# Altium project RFControllerSignalBoard.PrjPcb
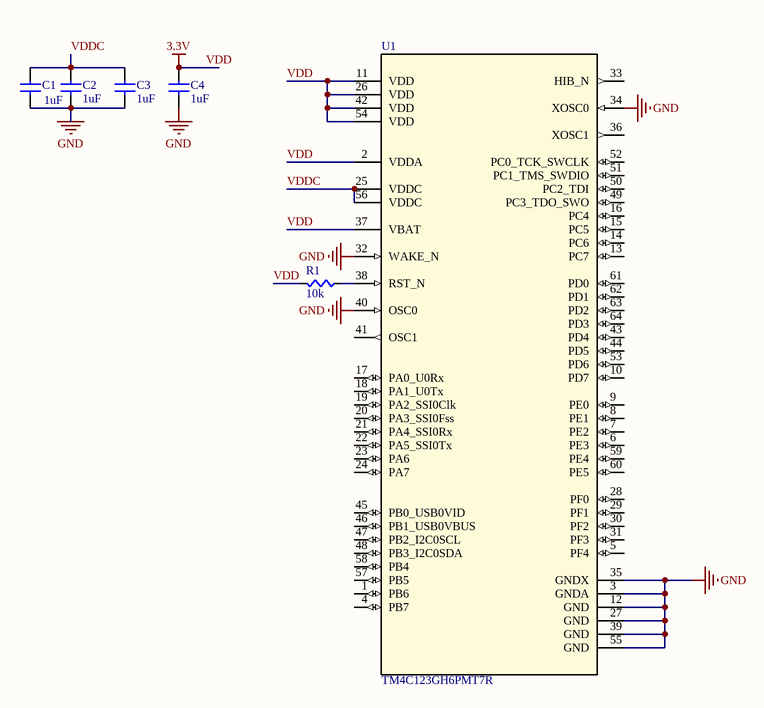
[diagram p0: MCU.SchDoc]
2 sheets, 16 parts. Net scope: global (net labels, ports and power ports of the same name join across sheets).
Sheets:
  MCU.SchDoc
  Power.SchDoc

## Sheet MCU.SchDoc
size A; SheetNumber: 1; SheetTotal: 3

### Parts
C1  value 1uF  [CAPC0805]  (hidden comment: Cap)
C2  value 1uF  [CAPC0805]  (hidden comment: Cap)
C3  value 1uF  [CAPC0805]  (hidden comment: Cap)
C4  value 1uF  [CAPC0805]  (hidden comment: Cap)
R1  value 10k  [RES0603]  (hidden comment: Res)
U1  TM4C123GH6PMT7R  [TM4C123GH6PMT7R_L]

### Nets
GND: C1.2(B) C2.2(B) C3.2(B) C4.2(B) U1.3(GNDA) U1.12(GND) U1.27(GND) U1.32(WAKE_N) U1.34(XOSC0) U1.35(GNDX) U1.39(GND) U1.40(OSC0) U1.55(GND)
VDD: C4.1(A) R1.1(A) U1.2(VDDA) U1.11(VDD) U1.26(VDD) U1.37(VBAT) U1.42(VDD) U1.54(VDD)  [also labelled 3.3V]
VDDC: C1.1(A) C2.1(A) C3.1(A) U1.25(VDDC) U1.56(VDDC)
NetR1_2: R1.2(B) U1.38(RST_N)

Not connected (* = marked no-connect by the designer): U1 1(PB6) 4(PB7) 5(PF4) 6(PE3) 7(PE2) 8(PE1) 9(PE0) 10(PD7) 13(PC7) 14(PC6) 15(PC5) 16(PC4) 17(PA0_U0Rx) 18(PA1_U0Tx) 19(PA2_SSI0Clk) 20(PA3_SSI0Fss) 21(PA4_SSI0Rx) 22(PA5_SSI0Tx) 23(PA6) 24(PA7) 28(PF0) 29(PF1) 30(PF2) 31(PF3) 33(HIB_N) 36(XOSC1) 41(OSC1) 43(PD4) 44(PD5) 45(PB0_USB0VID) 46(PB1_USB0VBUS) 47(PB2_I2C0SCL) 48(PB3_I2C0SDA) 49(PC3_TDO_SWO) 50(PC2_TDI) 51(PC1_TMS_SWDIO) 52(PC0_TCK_SWCLK) 53(PD6) 57(PB5) 58(PB4) 59(PE4) 60(PE5) 61(PD0) 62(PD1) 63(PD2) 64(PD3)

### Library data of the parts
U1 = TM4C123GH6PMT7R: Imported; PartNumber: TM4C123GH6PMTR; Manufacturer: Texas Instruments; CompType: IC; PIN_COUNT: 64; Application_BuildNumber: *; Alternate_PartNumber: TM4C123GH6PMT; PackageReference: PM0064A; MountType: SMT; RoHS: Y; RefDes: RefDes; TYPE: TYPE; Value: Value
C1-C4 = Cap: Supplier 1: Digi-Key; Supplier Part Number 1: 490-3905-1-ND
R1 = Res: Supplier 1: Digi-Key; Supplier Part Number 1: RMCF0603JT10K0CT-ND

## Sheet Power.SchDoc
size A; SheetNumber: 3; SheetTotal: 3
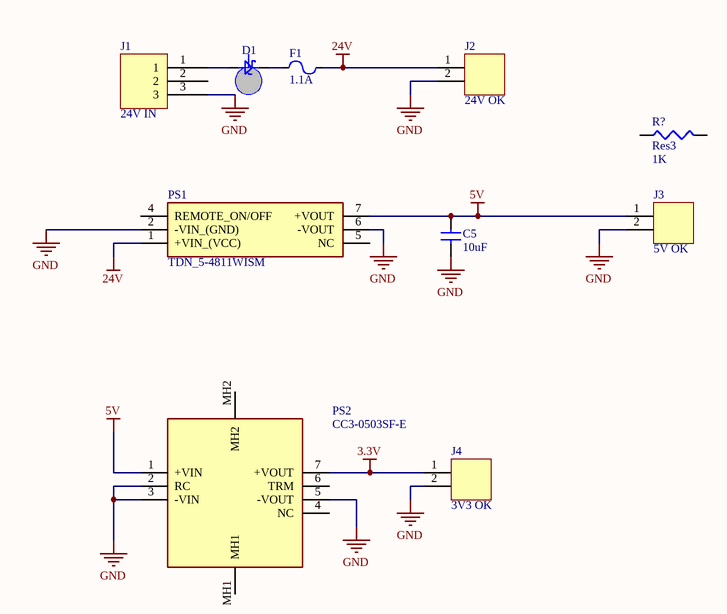
[diagram p1: Power.SchDoc]

### Parts
C5  value 10uF  [CAPC0805]  (hidden comment: Cap)
D1  VS-15MQ040NTRPBF  [SS110-TP]  (value not drawn)
F1  value 1.1A  [PTC7451X11N]  (hidden comment: PTC Fuse)
J1  24V IN  [MCV_0,5/3-G-2,5]
J2  24V OK  [MOLEX-HDR-1X2-SHERLOCK-VERT]
J3  5V OK  [MOLEX-HDR-1X2-SHERLOCK-VERT]
J4  3V3 OK  [MOLEX-HDR-1X2-SHERLOCK-VERT]
PS1  TDN_5-4811WISM  [TDN50910WISM]
PS2  CC3-0503SF-E  [CC30503SFE]
R?  Res3  value 1K  [J1-0603]

### Nets
3.3V: J4.1 PS2.7(+VOUT)  [project net VDD]
5V: C5.1(A) J3.1 PS1.7(+VOUT) PS2.1(+VIN)
24V: F1.1(A) J2.1 PS1.1(+VIN_(VCC))
GND: C5.2(B) J1.3 J2.2 J3.2 J4.2 PS1.2(-VIN_(GND)) PS1.6(-VOUT) PS2.2(RC) PS2.3(-VIN) PS2.5(-VOUT)
NetD1_A: D1.A J1.1
NetD1_C: D1.C F1.2(B)

Not connected (* = marked no-connect by the designer): J1 2; PS1 4(REMOTE_ON/OFF) 5(NC); PS2 4(NC) 6(TRM) MH1 MH2; R? 1 2

### Library data of the parts
D1 = VS-15MQ040NTRPBF: DIODE SCHOTTKY 40V 1.5A SMA; Manufacturer 1: Vishay Semiconductor Diodes Division; Supplier 1: Digi-Key; Supplier Part Number 1: 15MQ040NPBFCT-ND; Manufacturer Part Number 1: VS-15MQ040NTRPBF
F1 = PTC_Fuse: Supplier 1: Digi-Key; Supplier Part Number 1: 507-1744-1-ND
J1 = MCV_0,5/3-G-2,5: CONN TERM BLOCK 2.50MM 3POS, Vertical, Through-Hole, 4A; Manufacturer 1: Phoenix Contact; Manufacturer Part Number 1: 1881561; Mating Connector: 277-1431-ND; Supplier 1: Digi-Key; Supplier Part Number 1: 277-1453-ND
J2-J4 = MOLEX-HDR-1x2-SHERLOCK_VERT: Header, Molex, 2mm Pitch Sherlock Header, Single Row, Vertical, 2 Circuits, Length 3.3mm, 0353620250; Manufacturer Part Number: *; Order Part Number: *
PS1 = TDN_5-4811WISM: Power Supply; Manufacturer_Name: Traco Power; Manufacturer_Part_Number: TDN 5-4811WISM; Datasheet Link: https://tracopower.com/tdn5wism-datasheet/; Height: 10.7mm; Mouser Part Number: 495-TDN5-4811WISM; Mouser Price/Stock: https://www.mouser.co.uk/ProductDetail/TRACO-Power/TDN-5-4811WISM?qs=oIMkNKxjiKV4kofP0H7hzw%3D%3D
PS2 = CC3-0503SF-E: Power Supply; Manufacturer_Name: TDK; Datasheet Link: https://product.tdk.com/system/files/dam/doc/product/power/switching-power/dc-dc-converter/catalog/cc-e_e.pdf; Height: 8.5mm; Manufacturer_Part_Number: CC3-0503SF-E; Mouser Part Number: 967-CC3-0503SF-E; Mouser Price/Stock: https://www.mouser.com/Search/Refine.aspx?Keyword=967-CC3-0503SF-E; Arrow Part Number: CC3-0503SF-E; Arrow Price/Stock: https://www.arrow.com/en/products/cc3-0503sf-e/tdk-lambda-americas
R? = Res3: Resistor; Published: 8-Jun-2000; LatestRevisionDate: 29-May-2009; LatestRevisionNote: IPC-7351 Footprint Added.; PackageReference: J1-0603; Publisher: Altium Limited; PackageDescription: Chip Resistor
C5 = Cap: Supplier 1: Digi-Key; Supplier Part Number 1: 490-3905-1-ND

## Nets that join several sheets
GND: MCU (13 pins), Power (10 pins)
VDD: MCU (8 pins), Power (J4.1 PS2.7)